# Altium project Kasli-SOC.PrjPcb (part 10 of 11)

## Sheet Kasli-SOC_linear.SchDoc: LDOs
size 420 x 297 mm; CheckedBy: G.Kasprowicz; Author: F.Switakowski; CompanyName: WUT ISE; DrawnBy: F.Switakowski; Organization: WUT ISE; Address1: PW ISE; Address2: Nowowiejska 15/19 00-665 Warsaw; Address3: gkasprow@gmail.com; DocumentNumber: 17; Revision: 1; SheetNumber: 17; SheetTotal: 18; ModifiedBy: -; CheckedDate: -; Title2: & DDR reference; DivGrp: WUT ISE; Designer: G.Kasprowicz; ModifiedDate: -; ProjectName: Sensor Box
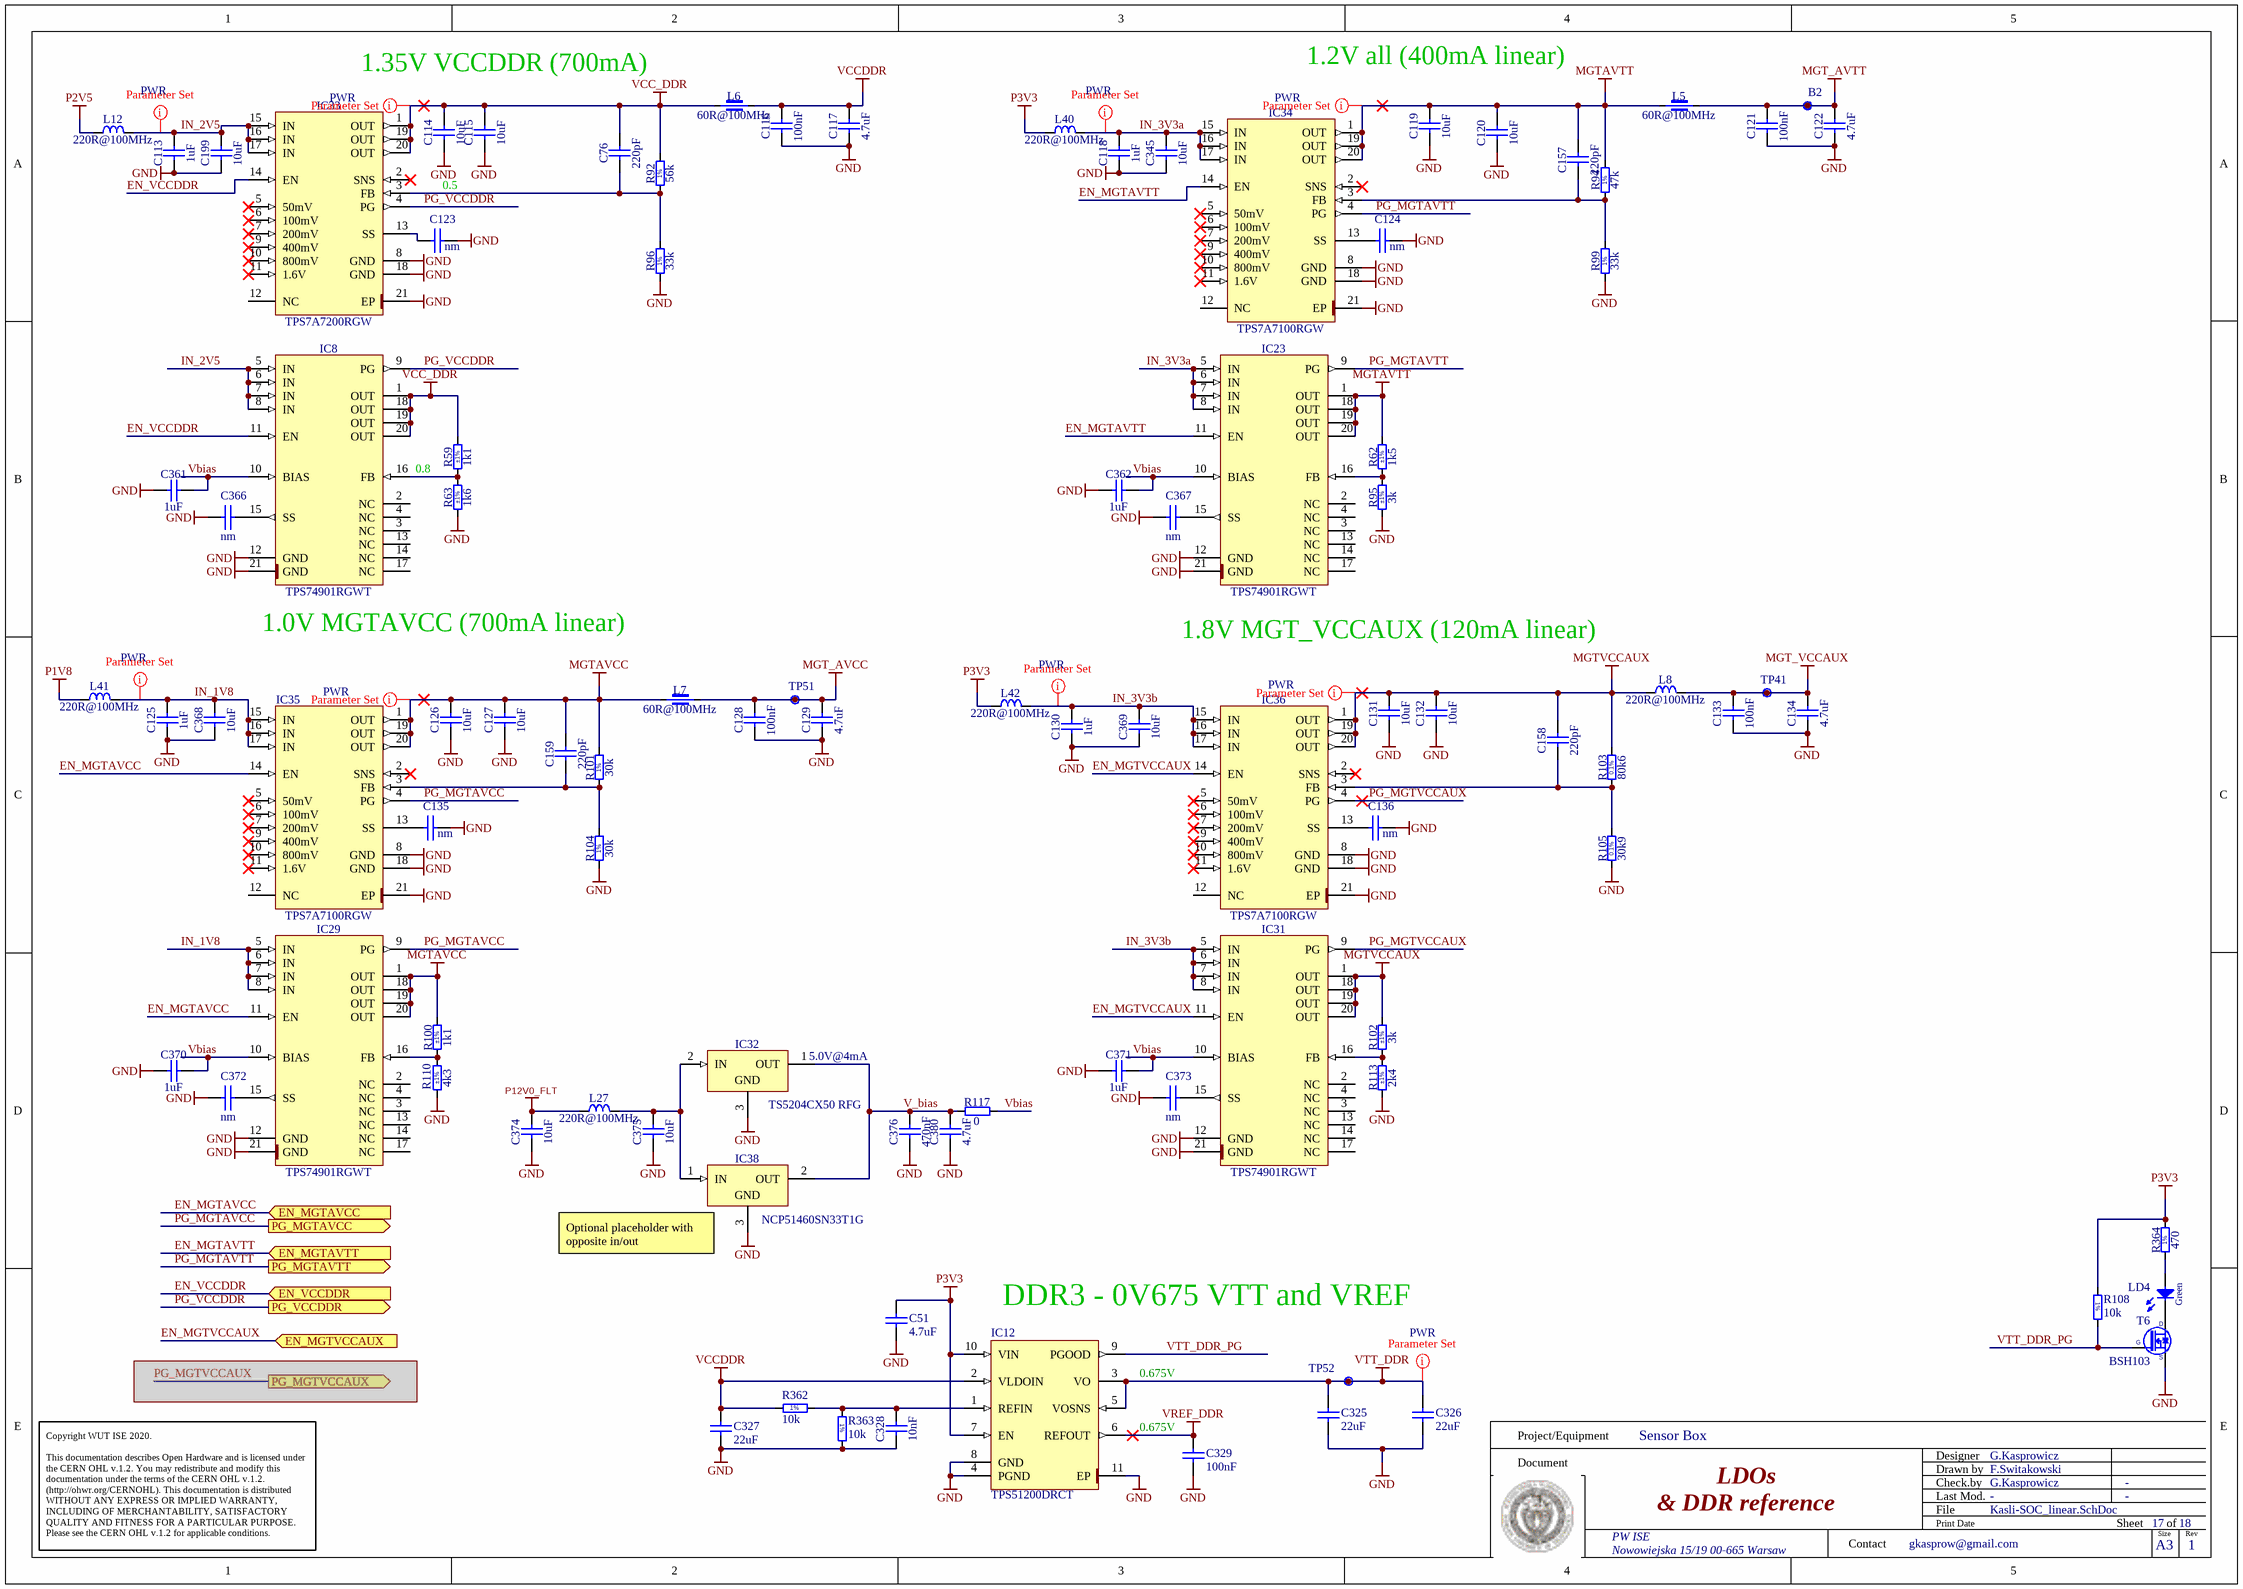
[diagram p15: Kasli-SOC_linear.SchDoc]

### Parts
B2  SMD Pad  [C75]  (value not drawn)  (no BOM)
C51  4.7uF  [CAPC1608X87N]
C76  220pF  [CAPC1005X55N]
C113  1uF  [CAPC1608X87N]
C114  10uF  [CAPC1005X70N]
C115  10uF  [CAPC1005X70N]
C116  100nF  [CAPC1005X55N]
C117  4.7uF  [CAPC1005X55N]
C118  1uF  [CAPC1608X87N]
C119  10uF  [CAPC1005X70N]
C120  10uF  [CAPC1005X70N]
C121  100nF  [CAPC1005X55N]
C122  4.7uF  [CAPC1005X55N]
C123  nm  [0402C]
C124  nm  [0402C]
C125  1uF  [CAPC1608X87N]
C126  10uF  [CAPC1005X70N]
C127  10uF  [CAPC1005X70N]
C128  100nF  [CAPC1005X55N]
C129  4.7uF  [CAPC1005X55N]
C130  1uF  [CAPC1608X87N]
C131  10uF  [CAPC1005X70N]
C132  10uF  [CAPC1005X70N]
C133  100nF  [CAPC1005X55N]
C134  4.7uF  [CAPC1005X55N]
C135  nm  [0402C]
C136  nm  [0402C]
C157  220pF  [CAPC1005X55N]
C158  220pF  [CAPC1005X55N]
C159  220pF  [CAPC1005X55N]
C199  10uF  [CAPC1005X70N]
C325  22uF  [CAPC3216X180N]
C326  22uF  [CAPC3216X180N]
C327  22uF  [CAPC3216X180N]
C328  10nF  [CAPC1005X55N]
C329  100nF  [CAPC1005X55N]
C345  10uF  [CAPC1005X70N]
C361  1uF  [CAPC1005X55N]
C362  1uF  [CAPC1005X55N]
C366  nm  [0402C]
C367  nm  [0402C]
C368  10uF  [CAPC1005X70N]
C369  10uF  [CAPC1005X70N]
C370  1uF  [CAPC1005X55N]
C371  1uF  [CAPC1005X55N]
C372  nm  [0402C]
C373  nm  [0402C]
C374  10uF  [CAPC2012X95N]
C375  10uF  [CAPC2012X95N]
C376  470nF  [CAPC1608X87N]
C380  4.7uF  [CAPC1005X55N]
IC8  TPS74901RGWT  [QFN65P500X500X100-21N-S325]
IC12  TPS51200DRCT  [TEXAS_DRC (S-PVSON-N10)]
IC23  TPS74901RGWT  [QFN65P500X500X100-21N-S325]
IC29  TPS74901RGWT  [QFN65P500X500X100-21N-S325]
IC31  TPS74901RGWT  [QFN65P500X500X100-21N-S325]
IC32  TS5204CX50 RFG  [SOT95P280X115-3N]
IC33  TPS7A7200RGW  [QFN65P500X500X100-21N-S325]
IC34  TPS7A7100RGW  [QFN65P500X500X100-21N-S325]
IC35  TPS7A7100RGW  [QFN65P500X500X100-21N-S325]
IC36  TPS7A7100RGW  [QFN65P500X500X100-21N-S325]
IC38  NCP51460SN33T1G  [SOT95P240X110-3N]
L5  60R@100MHz  [INDC4516X180N]
L6  60R@100MHz  [INDC4516X180N]
L7  60R@100MHz  [INDC4516X180N]
L8  220R@100MHz  [INDC2012X105N]
L12  220R@100MHz  [INDC2012X105N]
L27  220R@100MHz  [INDC2012X105N]
L40  220R@100MHz  [INDC2012X105N]
L41  220R@100MHz  [INDC2012X105N]
L42  220R@100MHz  [INDC2012X105N]
LD4  Green  [LED_KINGBRIGHT_KPH-1608CGCK]
R59  1k1  Tolerance: ±1%  [RESC1005X40N]
R62  1k5  Tolerance: ±1%  [RESC1005X40N]
R63  1k6  Tolerance: ±1%  [RESC1005X40N]
R92  56k  [RESC1005X40N]
R94  47k  [RESC1005X40N]
R95  3k  Tolerance: ±1%  [RESC1005X40N]
R96  33k  [RESC1005X40N]
R99  33k  [RESC1005X40N]
R100  1k1  Tolerance: ±1%  [RESC1005X40N]
R101  30k  [RESC1005X40N]
R102  3k  Tolerance: ±1%  [RESC1005X40N]
R103  80k6  [RESC1608X55N]
R104  30k  [RESC1005X40N]
R105  30k9  [RESC1608X55N]
R108  10k  [RESC1005X40N]
R110  4k3  Tolerance: ±1%  [RESC1005X40N]
R113  2k4  Tolerance: ±1%  [RESC1005X40N]
R117  0  [RESC1005X40N]
R362  10k  [RESC1005X40N]
R363  10k  [RESC1005X40N]
R364  470  [RESC1005X40N]
T6  BSH103  [SOT95P230X110-3N]
TP41  Test Point  [TPS127]  (value not drawn)  (no BOM)
TP51  Test Point  [TPS127]  (value not drawn)  (no BOM)
TP52  Test Point  [TPS127]  (value not drawn)  (no BOM)

### Ports
EN_MGTAVCC (in), EN_MGTAVTT (in), EN_MGTVCCAUX (in), EN_VCCDDR (in), PG_MGTAVCC (out), PG_MGTAVTT (out), PG_MGTVCCAUX (out), PG_VCCDDR (out)

### Nets
GND: C51.2 C113.1 C114.1 C115.1 C116.1 C117.1 C118.1 C119.1 C120.1 C121.1 C122.1 C123.2 C124.2 C125.1 C126.1 C127.1 C128.1 C129.1 C130.1 C131.1 C132.1 C133.1 C134.1 C135.2 C136.2 C199.1 C325.2 C326.2 C327.2 C328.1 C329.1 C345.1 C361.1 C362.1 C366.2 C367.2 C368.1 C369.1 C370.1 C371.1 C372.2 C373.2 C374.1 C375.1 C376.1 C380.1 IC8.12(GND) IC8.21(GND) IC12.4(PGND) IC12.8(GND) IC12.11(EP) IC23.12(GND) IC23.21(GND) IC29.12(GND) IC29.21(GND) IC31.12(GND) IC31.21(GND) IC32.3(GND) IC33.8(GND) IC33.18(GND) IC33.21(EP) IC34.8(GND) IC34.18(GND) IC34.21(EP) IC35.8(GND) IC35.18(GND) IC35.21(EP) IC36.8(GND) IC36.18(GND) IC36.21(EP) IC38.3(GND) R63.1 R95.1 R96.1 R99.1 R104.1 R105.1 R110.1 R113.1 R363.2 T6.2(S)
MGT_AVCC: C128.2 C129.2 L7.2 TP51.1
MGT_AVTT: B2.1 C121.2 C122.2 L5.2
MGT_VCCAUX: C133.2 C134.2 L8.2 TP41.1
MGTAVCC: C126.2 C127.2 C159.2 IC29.1(OUT) IC29.18(OUT) IC29.19(OUT) IC29.20(OUT) IC35.1(OUT) IC35.19(OUT) IC35.20(OUT) L7.1 R100.2 R101.2
MGTAVTT: C119.2 C120.2 C157.2 IC23.1(OUT) IC23.18(OUT) IC23.19(OUT) IC23.20(OUT) IC34.1(OUT) IC34.19(OUT) IC34.20(OUT) L5.1 R62.2 R94.2
MGTVCCAUX: C131.2 C132.2 C158.2 IC31.1(OUT) IC31.18(OUT) IC31.19(OUT) IC31.20(OUT) IC36.1(OUT) IC36.19(OUT) IC36.20(OUT) L8.1 R102.2 R103.2
P1V8: L41.1
P2V5: L12.1
P3V3: C51.1 IC12.7(EN) IC12.10(VIN) L40.1 L42.1 R108.1 R364.2
P12V0_FLT: C374.2 L27.1
VCC_DDR: C76.2 C114.2 C115.2 IC8.1(OUT) IC8.18(OUT) IC8.19(OUT) IC8.20(OUT) IC33.1(OUT) IC33.19(OUT) IC33.20(OUT) L6.1 R59.2 R92.2
VCCDDR: C116.2 C117.2 C327.1 IC12.2(VLDOIN) L6.2 R362.1
VREF_DDR: C329.2 IC12.6(REFOUT)
VTT_DDR: C325.1 C326.1 IC12.3(VO) IC12.5(VOSNS) TP52.1
EN_MGTAVCC: IC29.11(EN) IC35.14(EN) ; port EN_MGTAVCC
EN_MGTAVTT: IC23.11(EN) IC34.14(EN) ; port EN_MGTAVTT
EN_MGTVCCAUX: IC31.11(EN) IC36.14(EN) ; port EN_MGTVCCAUX
EN_VCCDDR: IC8.11(EN) IC33.14(EN) ; port EN_VCCDDR
IN_1V8: C125.2 C368.2 IC29.5(IN) IC29.6(IN) IC29.7(IN) IC29.8(IN) IC35.15(IN) IC35.16(IN) IC35.17(IN) L41.2
IN_2V5: C113.2 C199.2 IC8.5(IN) IC8.6(IN) IC8.7(IN) IC8.8(IN) IC33.15(IN) IC33.16(IN) IC33.17(IN) L12.2
IN_3V3a: C118.2 C345.2 IC23.5(IN) IC23.6(IN) IC23.7(IN) IC23.8(IN) IC34.15(IN) IC34.16(IN) IC34.17(IN) L40.2
IN_3V3b: C130.2 C369.2 IC31.5(IN) IC31.6(IN) IC31.7(IN) IC31.8(IN) IC36.15(IN) IC36.16(IN) IC36.17(IN) L42.2
PG_MGTAVCC: IC29.9(PG) IC35.4(PG) ; port PG_MGTAVCC
PG_MGTAVTT: IC23.9(PG) IC34.4(PG) ; port PG_MGTAVTT
PG_MGTVCCAUX: IC31.9(PG) IC36.4(PG)
PG_VCCDDR: IC8.9(PG) IC33.4(PG) ; port PG_VCCDDR
V_bias: C376.2 C380.2 IC32.1(OUT) IC38.2(OUT) R117.1
Vbias: C361.2 C362.2 C370.2 C371.2 IC8.10(BIAS) IC23.10(BIAS) IC29.10(BIAS) IC31.10(BIAS) R117.2
VTT_DDR_PG: IC12.9(PGOOD) R108.2 T6.1(G)
NetC76_1: C76.1 IC33.3(FB) R92.1 R96.2
NetC123_1: C123.1 IC33.13(SS)
NetC124_1: C124.1 IC34.13(SS)
NetC135_1: C135.1 IC35.13(SS)
NetC136_1: C136.1 IC36.13(SS)
NetC157_1: C157.1 IC34.3(FB) R94.1 R99.2
NetC158_1: C158.1 IC36.3(FB) R103.1 R105.2
NetC159_1: C159.1 IC35.3(FB) R101.1 R104.2
NetC328_2: C328.2 IC12.1(REFIN) R362.2 R363.1
NetC366_1: C366.1 IC8.15(SS)
NetC367_1: C367.1 IC23.15(SS)
NetC372_1: C372.1 IC29.15(SS)
NetC373_1: C373.1 IC31.15(SS)
NetC375_2: C375.2 IC32.2(IN) IC38.1(IN) L27.2
NetIC8_16: IC8.16(FB) R59.1 R63.2
NetIC23_16: IC23.16(FB) R62.1 R95.2
NetIC29_16: IC29.16(FB) R100.1 R110.2
NetIC31_16: IC31.16(FB) R102.1 R113.2
NetLD4_1: LD4.1(C) T6.3(D)
NetLD4_2: LD4.2(A) R364.1

Not connected (* = marked no-connect by the designer): IC8 2(NC) 3(NC) 4(NC) 13(NC) 14(NC) 17(NC); IC23 2(NC) 3(NC) 4(NC) 13(NC) 14(NC) 17(NC); IC29 2(NC) 3(NC) 4(NC) 13(NC) 14(NC) 17(NC); IC31 2(NC) 3(NC) 4(NC) 13(NC) 14(NC) 17(NC); IC33 2(SNS)* 5(50mV)* 6(100mV)* 7(200mV)* 9(400mV)* 10(800mV)* 11(1.6V)* 12(NC); IC34 2(SNS)* 5(50mV)* 6(100mV)* 7(200mV)* 9(400mV)* 10(800mV)* 11(1.6V)* 12(NC); IC35 2(SNS)* 5(50mV)* 6(100mV)* 7(200mV)* 9(400mV)* 10(800mV)* 11(1.6V)* 12(NC); IC36 2(SNS)* 5(50mV)* 6(100mV)* 7(200mV)* 9(400mV)* 10(800mV)* 11(1.6V)* 12(NC)

### Layout directives
net class PWR: IN_1V8, IN_2V5, IN_3V3a, IN_3V3b, MGTAVCC, MGTAVTT, MGTVCCAUX, VCC_DDR, VTT_DDR

### Notes on the sheet
- 1.35V VCCDDR (700mA)
- 1.2V all (400mA linear)
- 0.5
- 0.8
- (near IC8) 1.0V MGTAVCC (700mA linear)
- 1.8V MGT_VCCAUX (120mA linear)
- (near IC32) 5.0V@4mA
- (near IC38) Optional placeholder with opposite in/out
- (near IC12) DDR3 - 0V675 VTT and VREF
- (near IC12) 0.675V
- (near C329) 0.675V
- Project/Equipment
- Document
- Designer
- Drawn by
- Check.by
- Copyright WUT ISE 2020.
  This documentation describes Open Hardware and is licensed under the CERN OHL v.1.2. You may redistribute and modify this documentation under the terms of the CERN OHL v.1.2. (http://ohwr.org/CERNOHL). This documentation is distributed WITHOUT ANY EXPRESS OR IMPLIED WARRANTY, INCLUDING OF MERCHANTABILITY, SATISFACTORY QUALITY AND FITNESS FOR A PARTICULAR PURPOSE. Please see the CERN OHL v.1.2 for applicable conditions.
- Contact
- File
- Last Mod.
- Print Date
- Sheet
- Size
- A3
- of
- Rev
- (in symbol R0402_10K_1%_0.0625W_100PPM) 1%
- (in symbol R0402_30K_1%_0.0625W_100PPM) 1%
- (in symbol R0402_33K_1%_0.0625W_100PPM) 1%
- (in symbol R0402_47K_1%_0.0625W_100PPM) 1%
- (in symbol R0402_56K_1%_0.0625W_100PPM) 1%
- (in symbol R0402_470R_1%_0.0625W_100PPM) 1%
- (in symbol R0603_30K9_0.1%_0.063W_10PPM) 0.1%
- (in symbol R0603_80K6_0.1%_0.063W_10PPM) 0.1%

### Library data of the parts
B2 = SMD_PAD_D0.75MM: as B7-B10 on sheet Kasli-SOC_QUAD_BUCK; Part Number: SMD_PAD_D0.75MM; Component Type: Standard (No BOM); Pin Count: 1; Family: SMD Pad; Socket: No; SMD: No; Sense: No; Status: None; ComponentHeight: 0mm; HelpURL: Undefined; Author: CERN DEM BC; CreateDate: 04.06.2020; LatestRevisionDate: 04.06.2020; PackageDescription: 0.75mm Diameter SMD Pad
C51 = CC0603_4.7UF_6.3V_10%_X5R: Non-polarised capacitor; Part Description: SMD Multilayer Chip Ceramic Capacitor; Manufacturer: GENERIC; Manufacturer1 Part Number: 225520613672; Voltage: 6.3V; TC: X5R; Tolerance: ±10%; Table: Capacitors SMD; Part Number: CC0603_4.7UF_6.3V_10%_X5R; Component Kind: Standard; Component Type: Standard; Pin Count: 2; Value: 4.7uF; Status: Preferred; Manufacturer Part Number: CC0603_4.7uF_6.3V_10%_X5R; Case: 0603; Mounted: Yes; Socket: No; SMD: Yes; Manufacturer1 Example: PHYCOMP; Manufacturer1 ComponentHeight: 0.87mm; HelpURL: \\cern.ch\dfs\Applications\Altium\Datasheets\CC0805_X5R_PHYCOMP_HC.pdf; Author: CERN DEM JLC; CreateDate: 2007-12-03; LatestRevisionDate: 2007-12-03
C76 C157-C159 = CC0402_220PF_50V_5%_C0G: Non-polarised capacitor; Part Description: SMD Multilayer Chip Ceramic Capacitor; Manufacturer: GENERIC; Manufacturer1 Part Number: C0402C221J5GACTU; Voltage: 50V; TC: C0G/NP0; Tolerance: ±5%; Part Number: CC0402_220PF_50V_5%_C0G; Component Kind: Standard; Component Type: Standard; Pin Count: 2; Value: 220pF; Status: Preferred; Manufacturer Part Number: CC0402_220PF_50V_5%_C0G; Case: 0402; Mounted: Yes; Socket: No; SMD: Yes; Sense: No; Manufacturer1 Example: KEMET; Manufacturer1 ComponentHeight: 0.55mm; HelpURL: \\cern.ch\dfs\Applications\Altium\Datasheets\CC0402_C0G_KEMET_(Commercial Grade).pdf; Author: CERN DEM JLC; CreateDate: 03.12.2007; LatestRevisionDate: 22.04.2015
C113 C118 C125 C130 = CC0603_1UF_25V_10%_X7R: Non-polarised capacitor; Part Description: SMD Multilayer Chip Ceramic Capacitor; Manufacturer: GENERIC; Manufacturer1 Part Number: GRM188R71E105KA12D; Voltage: 25V; TC: X7R; Tolerance: ±10%; Part Number: CC0603_1UF_25V_10%_X7R; Component Kind: Standard; Component Type: Standard; Pin Count: 2; Value: 1uF; Status: None; Manufacturer Part Number: CC0603_1UF_25V_10%_X7R; Case: 0603; Mounted: Yes; Socket: No; SMD: Yes; Sense: No; Manufacturer1 Example: MURATA; Manufacturer1 ComponentHeight: 0.9mm; HelpURL: \\cern.ch\dfs\Applications\Altium\Datasheets\CC0603_X7R_MURATA.pdf; Author: CERN DEM JLC; CreateDate: 18.01.2011; LatestRevisionDate: 18.01.2011
C114 C115 C119 C120 C126 C127 C131 C132 C199 C345 C368 C369 = CC0402_10UF_6.3V_20%_X5R: Non-polarised capacitor; Part Description: SMD Multilayer Chip Ceramic Capacitor; Manufacturer: GENERIC; Manufacturer1 Part Number: C1005X5R0J106M050BC; Voltage: 6.3V; TC: X5R; Tolerance: ±10%; Part Number: CC0402_10UF_6.3V_20%_X5R; Component Kind: Standard; Component Type: Standard; Pin Count: 2; Value: 10uF; Status: Preferred; Manufacturer Part Number: CC0402_10UF_6.3V_20%_X5R; Case: 0402; Mounted: Yes; Socket: No; SMD: Yes; Sense: No; Manufacturer1 Example: TDK; Manufacturer1 ComponentHeight: 0.70mm; HelpURL: \\cern.ch\dfs\Applications\Altium\Datasheets\CC0402_X5R_TDK_C.pdf; Author: CERN DEM JLC; CreateDate: 07.01.2015; LatestRevisionDate: 07.01.2015
C116 C121 C128 C133 = CC0402_100NF_16V_10%_X7R: as C146-C153 on sheet Kasli-SOC_QUAD_BUCK; Part Number: CC0402_100NF_16V_10%_X7R; Component Kind: Standard; Component Type: Standard; Pin Count: 2; Value: 100nF; Status: Not Recommended; Manufacturer Part Number: CC0402_100NF_16V_10%_X7R; Case: 0402; Mounted: Yes; Socket: No; SMD: Yes; Sense: No; Manufacturer1 Example: MURATA; Manufacturer1 ComponentHeight: 0.55mm; HelpURL: \\cern.ch\dfs\Applications\Altium\Datasheets\CC0402_X7R_MURATA_GRM.pdf; Author: CERN DEM JLC; CreateDate: 05/12/2013; LatestRevisionDate: 03/12/2007
C117 C122 C129 C134 C380 = CC0402_4.7UF_6.3V_20%_X5R: Non-polarised capacitor; Part Description: SMD Multilayer Chip Ceramic Capacitor; Manufacturer: GENERIC; Manufacturer1 Part Number: C1005X5R0J475M050BC; Voltage: 6.3V; TC: X5R; Tolerance: ±20%; Part Number: CC0402_4.7UF_6.3V_20%_X5R; Component Kind: Standard; Component Type: Standard; Pin Count: 2; Value: 4.7uF; Status: Preferred; Manufacturer Part Number: CC0402_4.7UF_6.3V_20%_X5R; Case: 0402; Mounted: Yes; Socket: No; SMD: Yes; Sense: No; Manufacturer1 Example: TDK; Manufacturer1 ComponentHeight: 0.65mm; HelpURL: \\cern.ch\dfs\Applications\Altium\Datasheets\CC0402_X5R_TDK_C.pdf; Author: CERN DEM JLC; CreateDate: 03/03/2015; LatestRevisionDate: 03/03/2015
C123 C124 C135 C136 C366 C367 C372 C373 = CAP_SMD_0402: Capacitor SMD
C325-C327 = CC1206_22UF_10V_10%_X7R: Non-polarised capacitor; Part Description: SMD Multilayer Chip Ceramic Capacitor; Manufacturer: GENERIC; Manufacturer1 Part Number: GRM31CR71A226KE15L; Voltage: 10V; TC: X7R; Tolerance: ±10%; Table: Capacitors SMD; Part Number: CC1206_22UF_10V_10%_X7R; Component Kind: Standard; Component Type: Standard; Pin Count: 2; Value: 22uF; Status: Preferred; Manufacturer Part Number: CC1206_22UF_10V_10%_X7R; Case: 1206; Mounted: Yes; Socket: No; SMD: Yes; Manufacturer1 Example: MURATA; Manufacturer1 ComponentHeight: 1.8mm; HelpURL: \\cern.ch\dfs\Applications\Altium\Datasheets\CC1206_X7R_MURATA_GRM-HI-CAP.pdf; Author: CERN DEM JLC; CreateDate: 2010-06-08; LatestRevisionDate: 2010-06-08
C328 = CC0402_10NF_16V_10%_X7R: Non-polarised capacitor; Part Description: SMD Multilayer Chip Ceramic Capacitor; Manufacturer: GENERIC; Manufacturer1 Part Number: 223878715636; Voltage: 16V; TC: X7R; Tolerance: ±10%; Part Number: CC0402_10NF_16V_10%_X7R; Component Kind: Standard; Component Type: Standard; Pin Count: 2; Value: 10nF; Status: Not Recommended; Manufacturer Part Number: CC0402_10NF_16V_10%_X7R; Case: 0402; Mounted: Yes; Socket: No; SMD: Yes; Sense: No; Manufacturer1 Example: PHYCOMP; Manufacturer1 ComponentHeight: 0.55mm; HelpURL: \\cern.ch\dfs\Applications\Altium\Datasheets\CC0402_X7R_PHYCOMP.pdf; Author: CERN DEM JLC; CreateDate: 03.12.2007; LatestRevisionDate: 03.12.2007
C329 = CC0402_100NF_16V_10%_X7R: Non-polarised capacitor; Part Description: SMD Multilayer Chip Ceramic Capacitor; Manufacturer: GENERIC; Manufacturer1 Part Number: GRM155R71C104KA88D; Voltage: 16V; TC: X7R; Tolerance: ±10%; Table: Capacitors SMD; Part Number: CC0402_100NF_16V_10%_X7R; Component Kind: Standard; Component Type: Standard; Pin Count: 2; Value: 100nF; Status: Not Recommended; Manufacturer Part Number: CC0402_100NF_16V_10%_X7R; Case: 0402; Mounted: Yes; Socket: No; SMD: Yes; Manufacturer1 Example: MURATA; Manufacturer1 ComponentHeight: 0.55mm; HelpURL: \\cern.ch\dfs\Applications\Altium\Datasheets\CC0402_X7R_MURATA_GRM.pdf; Author: CERN DEM JLC; CreateDate: 2013-12-05; LatestRevisionDate: 2007-12-03
C361 C362 C370 C371 = CC0402_1UF_16V_10%_X5R: Non-polarised capacitor; Part Description: SMD Multilayer Chip Ceramic Capacitor; Manufacturer: GENERIC; Manufacturer1 Part Number: C1005X5R1C105KT; Voltage: 16V; TC: X5R; Tolerance: ±10%; Part Number: CC0402_1UF_16V_10%_X5R; Component Kind: Standard; Component Type: Standard; Pin Count: 2; Value: 1uF; Status: Preferred; Manufacturer Part Number: CC0402_1UF_16V_10%_X5R; Case: 0402; Mounted: Yes; Socket: No; SMD: Yes; Sense: No; Manufacturer1 Example: TDK; Manufacturer1 ComponentHeight: 0.55mm; HelpURL: \\cern.ch\dfs\Applications\Altium\Datasheets\CC0402_X5R_TDK_C.pdf; Author: CERN DEM JLC; CreateDate: 25.10.2012; LatestRevisionDate: 25.10.2012
C374 C375 = CC0805_10UF_25V_10%_X5R: Non-polarised capacitor; Part Description: SMD Multilayer Chip Ceramic Capacitor; Manufacturer: GENERIC; Manufacturer1 Part Number: GRM219R61E106KA12D; Voltage: 25V; TC: X5R; Tolerance: ±10%; Part Number: CC0805_10UF_25V_10%_X5R; Component Kind: Standard; Component Type: Standard; Pin Count: 2; Value: 10uF; Status: Preferred; Manufacturer Part Number: CC0805_10UF_25V_10%_X5R; Case: 0805; Mounted: Yes; Socket: No; SMD: Yes; Sense: No; Manufacturer1 Example: MURATA; Manufacturer1 ComponentHeight: 0.95mm; HelpURL: \\cern.ch\dfs\Applications\Altium\Datasheets\CC0805_X5R_MURATA_GRM.pdf; Author: CERN DEM JLC; CreateDate: 25.10.2012; LatestRevisionDate: 06.09.2016
C376 = CC0603_470NF_16V_10%_X5R: Non-polarised capacitor; Part Description: SMD Multilayer Chip Ceramic Capacitor; Manufacturer: GENERIC; Manufacturer1 Part Number: 223878613658; Voltage: 16V; TC: X5R; Tolerance: ±10%; Part Number: CC0603_470NF_16V_10%_X5R; Component Kind: Standard; Component Type: Standard; Pin Count: 2; Value: 470nF; Status: Preferred; Manufacturer Part Number: CC0603_470NF_16V_10%_X5R; Case: 0603; Mounted: Yes; Socket: No; SMD: Yes; Sense: No; Manufacturer1 Example: PHYCOMP; Manufacturer1 ComponentHeight: 0.87mm; HelpURL: \\cern.ch\dfs\Applications\Altium\Datasheets\CC0805_X5R_PHYCOMP_HC.pdf; Author: CERN DEM JLC; CreateDate: 03.12.2007; LatestRevisionDate: 03.12.2007
IC8 IC23 IC29 IC31 = TPS74901RGWT: 3A, 0.8 to 3.6V Adjustable Low-Dropout Linear Regulator with Programmable Soft-Start; Part Description: 0.8V to 3.6V, 3.0A Low Dropout Linear Regulator with Programmable Soft-Start; Manufacturer: TEXAS INSTRUMENTS; PressFit: No; Bonding: No; Part Number: TPS74901RGWT; Component Kind: Standard; Component Type: Standard; Device: TPS74901RGWT; PackageDescription: QFN, 0.65mm Pitch, Square; 20 Pin, 5.00mm L X 5.00mm W X 1.00mm H body (w/Thermal Tab 3.25 X 3.25mm), IPC Medium Density; Manufacturer Part Number: TPS74901RGW; Pin Count: 21; Case: QFN20; Mounted: Yes; Socket: No; SMD: Yes; Sense: No; ComponentHeight: 1mm; HelpURL: \\cern.ch\dfs\Applications\Altium\Datasheets\TPS74901RGWT.pdf; Author: CERN DEM JLC; CreateDate: 07.03.2013; LatestRevisionDate: 13.06.2022
IC12 = TPS51200DRCT: Sink/Source DDR Termination Regulator; Part Description: 3.3V Sink/Source DDR Termination Regulator; Manufacturer: TEXAS INSTRUMENTS; Table: Regulators; Part Number: TPS51200DRCT; Component Kind: Standard; Component Type: Standard; Device: TPS51200DRCT; PackageDescription: SON, 0.50mm Pitch, 10-pin, 3.00mm W  X 3.00mm L X 1.00mm Height, (w/thermal tab 1.75 X 2.50 mm); Manufacturer Part Number: TPS51200DRCT; Pin Count: 11; Case: SON10; Mounted: Yes; Socket: No; SMD: Yes; ComponentHeight: 1mm; HelpURL: \\cern.ch\dfs\Applications\Altium\Datasheets\TPS51200DRCT.pdf; Author: CERN DEM JLC; CreateDate: 2010-02-03; LatestRevisionDate: 2013-11-06
IC32 = TS3480CX33RF: 3-Terminal Regulator 1=OUT 2=IN 3=GND; Part Description: 5.0 Low Quiescient Current LDO Voltage Regulator; Manufacturer: TAIWAN SEMICONDUCTOR; PressFit: No; Bonding: No; Part Number: TS5204CX50 RFG; Component Kind: Standard; Component Type: Standard; Device: TS5204CX50 RFG; PackageDescription: SOT23SOT, 0.95mm Pitch; 3 Pin, 1.55mm W X 2.95mm L X 1.15mm H body, IPC Medium Density; Manufacturer Part Number: TS5204CX50 RFG; Pin Count: 3; Case: SOT23; Mounted: Yes; Socket: No; SMD: Yes; Sense: No; ComponentHeight: 1.15mm; HelpURL: \\cern.ch\dfs\Applications\Altium\Datasheets\TS3480CX33RF.pdf; Author: CERN DEM JLC; CreateDate: 19.05.2010; LatestRevisionDate: 19.05.2010
IC33 = TPS7A7200RGW: 2-A, Fast-Transient, Low-Dropout Voltage Regulator; Manufacturer: TEXAS INSTRUMENTS; PressFit: No; Bonding: No; Part Number: TPS7A7200RGW; Component Kind: Standard; Component Type: Standard; Device: TPS7A7200RGW; PackageDescription: QFN, 0.65mm pitch,square; 20 pin, 5mm X 5mm X 1mm H body (w/thermal tab 3.25 X 3.25mm),  IPC Medium Density; Part Description: 2-A, Fast-Transient, Low-Dropout Voltage Regulator; Manufacturer Part Number: TPS7A7200RGW; Pin Count: 21; Case: QFN20; Mounted: Yes; Socket: No; SMD: Yes; Sense: No; ComponentHeight: 1mm; HelpURL: \\cern.ch\dfs\Applications\Altium\Datasheets\TPS7A7200RGW.pdf; Author: CERN DEM MR; CreateDate: 17.03.2016; LatestRevisionDate: 17.03.2016
IC34-IC36 = TPS7A7100RGW: 1-A, Fast-Transient, Low-Dropout Voltage Regulator; Manufacturer: TEXAS INSTRUMENTS; PressFit: No; Bonding: No; Part Number: TPS7A7100RGW; Component Kind: Standard; Component Type: Standard; Device: TPS7A7100RGW; PackageDescription: QFN, 0.65mm pitch,square; 20 pin, 5mm X 5mm X 1mm H body (w/thermal tab 3.25 X 3.25mm),  IPC Medium Density; Part Description: 1-A, Fast-Transient, Low-Dropout Voltage Regulator; Manufacturer Part Number: TPS7A7100RGW; Pin Count: 21; Case: QFN20; Mounted: Yes; Socket: No; SMD: Yes; Sense: No; ComponentHeight: 1mm; HelpURL: \\cern.ch\dfs\Applications\Altium\Datasheets\TPS7A7100RGW.pdf; Author: CERN DEM MR; CreateDate: 17.03.2016; LatestRevisionDate: 17.03.2016
IC38 = NCP51460SN33T1G: 3-Terminal Regulator 1=IN 2=OUT 3=GND; Part Number: NCP51460SN50T1G; Part Description: 3.3V, 20mA Micropower Precision Voltage Reference; Manufacturer: ON SEMICONDUCTOR; PressFit: No; Bonding: No; Component Kind: Standard; Component Type: Standard; Device: NCP51460SN33T1G; PackageDescription: SOT23 3-Leads, Pitch 0.95mm - Body 1.4x3mm, IPC Medium Density; Manufacturer Part Number: NCP51460SN33T1; Pin Count: 3; Case: SOT23; Mounted: Yes; Socket: No; SMD: Yes; Sense: No; ComponentHeight: 1.1mm; HelpURL: \\cern.ch\dfs\Applications\Altium\Datasheets\NCP51460SN33T1G.pdf; Author: CERN DEM MR; CreateDate: 05.10.2016; LatestRevisionDate: 24.05.2022
L5-L7 = IND1806_MURATA_BLM41PG600SN1L: Manufacturer: MURATA; Part Description: SMD EMI Suppression Chip Ferrite Bead (BLM41P Series); Power: 6A; Resistance: 0.01R; Manufacturer Part Number: BLM41PG600SN1L; Part Number: IND1806_MURATA_BLM41PG600SN1L; Value: 60R@100MHz; Component Kind: Standard; Component Type: Standard; Pin Count: 2; Status: None; Case: 1806; Mounted: Yes; Socket: No; SMD: Yes; Sense: No; ComponentHeight: 1.8mm; HelpURL: \\cern.ch\dfs\Applications\Altium\Datasheets\IND1806_MURATA_BLM41P.pdf; Author: CERN DEM JLC; CreateDate: 02.12.2009; LatestRevisionDate: 02.12.2009
L8 L12 L27 L40-L42 = IND0805_MURATA_BLM21PG221SN1D: Inductor; Part Description: SMD EMIFIL Suppression Chip Ferrite Bead; Manufacturer: MURATA; Power: 2A; Resistance: 0.05R; Tolerance: ±25%; Part Number: IND0805_MURATA_BLM21PG221SN1D; Component Kind: Standard; Component Type: Standard; Pin Count: 2; Value: 220R@100MHz; Status: None; Manufacturer Part Number: BLM21PG221SN1D; Case: 0805; Mounted: Yes; Socket: No; SMD: Yes; Sense: No; ComponentHeight: 1.05mm; HelpURL: \\cern.ch\dfs\Applications\Altium\Datasheets\IND0805_MURATA_BLM21P.pdf; Author: CERN DEM JLC; CreateDate: 25/01/2010; LatestRevisionDate: 25/01/2010
LD4 = LED_KINGBRIGHT_KPH-1608CGCK: LED Green 1C 2A; Part Description: SMD Green LED, Case 1.6mmX0.8mm(0603), 0.65mm Thickness; PressFit: No; Bonding: No; Manufacturer Part Number: KPH-1608CGCK; ComponentHeight: 0.65mm; HelpURL: \\cern.ch\dfs\Applications\Altium\Datasheets\LED_KINGBRIGHT_KPH-1608CGCK.pdf; Part Number: LED_KINGBRIGHT_KPH-1608CGCK; Component Kind: Standard; Component Type: Standard; Color: Green; PackageDescription: SMT Green LED, Case 0603, Body L 1.6 x W 0.8mm H 0.65mm; Manufacturer: KINGBRIGHT; Pin Count: 2; Mounted: Yes; Socket: No; SMD: Yes; Sense: No; Author: CERN DEM JLC; CreateDate: 03.07.2017; LatestRevisionDate: 03.07.2017
R59 R100 = R0402_1K1_1%_0.0625W_100PPM: Resistor - 1%; Part Description: General Purpose Thick Film Chip Resistor; Manufacturer: GENERIC; Manufacturer1 Part Number: 232270671102L; TC: ±100ppm/°C; PressFit: No; Part Number: R0402_1K1_1%_0.0625W_100PPM; Component Kind: Standard; Component Type: Standard; Pin Count: 2; Value: 1k1; Status: Not Recommended; Power: 0.0625W; Manufacturer Part Number: R0402_1K1_1%_0.0625W_100PPM; Case: 0402; Mounted: Yes; Sense: No; Socket: No; SMD: Yes; Manufacturer1 Example: YAGEO PHYCOMP; Manufacturer1 ComponentHeight: 0.4mm; HelpURL: \\cern.ch\dfs\Applications\Altium\Datasheets\R0402_Phycomp_RC0402.pdf; Author: CERN DEM JLC; CreateDate: 03.12.2007; LatestRevisionDate: 17.10.2012
R62 = R0402_1K5_1%_0.0625W_100PPM: Resistor - 1%; Part Description: General Purpose Thick Film Chip Resistor; Manufacturer: GENERIC; Manufacturer1 Part Number: 232270671502L; TC: ±100ppm/°C; PressFit: No; Part Number: R0402_1K5_1%_0.0625W_100PPM; Component Kind: Standard; Component Type: Standard; Pin Count: 2; Value: 1k5; Status: Not Recommended; Power: 0.0625W; Manufacturer Part Number: R0402_1K5_1%_0.0625W_100PPM; Case: 0402; Mounted: Yes; Sense: No; Socket: No; SMD: Yes; Manufacturer1 Example: YAGEO PHYCOMP; Manufacturer1 ComponentHeight: 0.4mm; HelpURL: \\cern.ch\dfs\Applications\Altium\Datasheets\R0402_Phycomp_RC0402.pdf; Author: CERN DEM JLC; CreateDate: 03.12.2007; LatestRevisionDate: 17.10.2012
R63 = R0402_1K6_1%_0.0625W_100PPM: Resistor - 1%; Part Description: General Purpose Thick Film Chip Resistor; Manufacturer: GENERIC; Manufacturer1 Part Number: 232270671602L; TC: ±100ppm/°C; PressFit: No; Part Number: R0402_1K6_1%_0.0625W_100PPM; Component Kind: Standard; Component Type: Standard; Pin Count: 2; Value: 1k6; Status: Not Recommended; Power: 0.0625W; Manufacturer Part Number: R0402_1K6_1%_0.0625W_100PPM; Case: 0402; Mounted: Yes; Sense: No; Socket: No; SMD: Yes; Manufacturer1 Example: YAGEO PHYCOMP; Manufacturer1 ComponentHeight: 0.4mm; HelpURL: \\cern.ch\dfs\Applications\Altium\Datasheets\R0402_Phycomp_RC0402.pdf; Author: CERN DEM JLC; CreateDate: 03.12.2007; LatestRevisionDate: 17.10.2012
R92 = R0402_56K_1%_0.0625W_100PPM: Resistor - 1%; Part Description: General Purpose Thick Film Chip Resistor; Manufacturer: GENERIC; Manufacturer1 Part Number: 232270675603L; TC: ±100ppm/°C; Part Number: R0402_56K_1%_0.0625W_100PPM; Component Kind: Standard; Component Type: Standard; Pin Count: 2; Value: 56k; Status: Not recommended; Power: 0.0625W; Tolerance: ±1%; Manufacturer Part Number: R0402_56K_1%_0.0625W_100PPM; Case: 0402; Mounted: Yes; Sense: No; Socket: No; SMD: Yes; Manufacturer1 Example: YAGEO PHYCOMP; Manufacturer1 ComponentHeight: 0.4mm; HelpURL: \\cern.ch\dfs\Applications\Altium\Datasheets\R0402_Phycomp_RC0402.pdf; Author: CERN DEM JLC; CreateDate: 03.12.2007; LatestRevisionDate: 17.10.2012
R94 = R0402_47K_1%_0.0625W_100PPM: Resistor - 1%; Part Description: General Purpose Thick Film Chip Resistor; Manufacturer: GENERIC; Manufacturer1 Part Number: 232270675103L; TC: ±100ppm/°C; Part Number: R0402_47K_1%_0.0625W_100PPM; Component Kind: Standard; Component Type: Standard; Pin Count: 2; Value: 47k; Status: Not recommended; Power: 0.0625W; Tolerance: ±1%; Manufacturer Part Number: R0402_47K_1%_0.0625W_100PPM; Case: 0402; Mounted: Yes; Sense: No; Socket: No; SMD: Yes; Manufacturer1 Example: YAGEO PHYCOMP; Manufacturer1 ComponentHeight: 0.4mm; HelpURL: \\cern.ch\dfs\Applications\Altium\Datasheets\R0402_Phycomp_RC0402.pdf; Author: CERN DEM JLC; CreateDate: 03.12.2007; LatestRevisionDate: 17.10.2012
R95 R102 = R0402_3K_1%_0.0625W_100PPM: Resistor - 1%; Part Description: General Purpose Thick Film Chip Resistor; Manufacturer: GENERIC; Manufacturer1 Part Number: 232270673002L; TC: ±100ppm/°C; PressFit: No; Part Number: R0402_3K_1%_0.0625W_100PPM; Component Kind: Standard; Component Type: Standard; Pin Count: 2; Value: 3k; Status: Not Recommended; Power: 0.0625W; Manufacturer Part Number: R0402_3K_1%_0.0625W_100PPM; Case: 0402; Mounted: Yes; Sense: No; Socket: No; SMD: Yes; Manufacturer1 Example: YAGEO PHYCOMP; Manufacturer1 ComponentHeight: 0.4mm; HelpURL: \\cern.ch\dfs\Applications\Altium\Datasheets\R0402_Phycomp_RC0402.pdf; Author: CERN DEM JLC; CreateDate: 03.12.2007; LatestRevisionDate: 17.10.2012
R96 R99 = R0402_33K_1%_0.0625W_100PPM: Resistor - 1%; Part Description: General Purpose Thick Film Chip Resistor; Manufacturer: GENERIC; Manufacturer1 Part Number: 232270673303L; TC: ±100ppm/°C; Part Number: R0402_33K_1%_0.0625W_100PPM; Component Kind: Standard; Component Type: Standard; Pin Count: 2; Value: 33k; Status: Not recommended; Power: 0.0625W; Tolerance: ±1%; Manufacturer Part Number: R0402_33K_1%_0.0625W_100PPM; Case: 0402; Mounted: Yes; Sense: No; Socket: No; SMD: Yes; Manufacturer1 Example: YAGEO PHYCOMP; Manufacturer1 ComponentHeight: 0.4mm; HelpURL: \\cern.ch\dfs\Applications\Altium\Datasheets\R0402_Phycomp_RC0402.pdf; Author: CERN DEM JLC; CreateDate: 03.12.2007; LatestRevisionDate: 17.10.2012
R101 R104 = R0402_30K_1%_0.0625W_100PPM: Resistor - 1%; Part Description: General Purpose Thick Film Chip Resistor; Manufacturer: GENERIC; Manufacturer1 Part Number: 232270673003L; TC: ±100ppm/°C; Part Number: R0402_30K_1%_0.0625W_100PPM; Component Kind: Standard; Component Type: Standard; Pin Count: 2; Value: 30k; Status: Not recommended; Power: 0.0625W; Tolerance: ±1%; Manufacturer Part Number: R0402_30K_1%_0.0625W_100PPM; Case: 0402; Mounted: Yes; Sense: No; Socket: No; SMD: Yes; Manufacturer1 Example: YAGEO PHYCOMP; Manufacturer1 ComponentHeight: 0.4mm; HelpURL: \\cern.ch\dfs\Applications\Altium\Datasheets\R0402_Phycomp_RC0402.pdf; Author: CERN DEM JLC; CreateDate: 03.12.2007; LatestRevisionDate: 17.10.2012
R103 = R0603_80K6_0.1%_0.063W_10PPM: Resistor - 0.1%; Part Description: Thin Film Chip Resistor; Manufacturer: GENERIC; Manufacturer1 Part Number: RN73C1J80K6BTDF; Power: 0.063W; TC: ±10ppm; PressFit: No; Part Number: R0603_80K6_0.1%_0.063W_10PPM; Component Kind: Standard; Component Type: Standard; Pin Count: 2; Value: 80k6; Status: Not Recommended; Tolerance: ±0.1%; Manufacturer Part Number: R0603_80K6_0.1%_0.063W_10PPM; Case: 0603; Mounted: Yes; Sense: No; Socket: No; SMD: Yes; Manufacturer1 Example: TYCO HOLSWORTHY; Manufacturer1 ComponentHeight: 0.5mm; HelpURL: \\cern.ch\dfs\Applications\Altium\Datasheets\R0603_Tyco_RN73.pdf; Author: CERN DEM JLC; CreateDate: 03.12.2007; LatestRevisionDate: 13.03.2008
R105 = R0603_30K9_0.1%_0.063W_10PPM: Resistor - 0.1%; Part Description: Thin Film Chip Resistor; Manufacturer: GENERIC; Manufacturer1 Part Number: RN73C1J30K9BTDF; Power: 0.063W; TC: ±10ppm; PressFit: No; Part Number: R0603_30K9_0.1%_0.063W_10PPM; Component Kind: Standard; Component Type: Standard; Pin Count: 2; Value: 30k9; Status: Not Recommended; Tolerance: ±0.1%; Manufacturer Part Number: R0603_30K9_0.1%_0.063W_10PPM; Case: 0603; Mounted: Yes; Sense: No; Socket: No; SMD: Yes; Manufacturer1 Example: TYCO HOLSWORTHY; Manufacturer1 ComponentHeight: 0.5mm; HelpURL: \\cern.ch\dfs\Applications\Altium\Datasheets\R0603_Tyco_RN73.pdf; Author: CERN DEM JLC; CreateDate: 03.12.2007; LatestRevisionDate: 13.03.2008
R108 R362 R363 = R0402_10K_1%_0.0625W_100PPM: Resistor - 1%; Part Description: General Purpose Thick Film Chip Resistor; Manufacturer: GENERIC; Manufacturer1 Part Number: 232270671003L; TC: ±100ppm/°C; Table: Resistors SMD; Part Number: R0402_10K_1%_0.0625W_100PPM; Component Kind: Standard; Component Type: Standard; Pin Count: 2; Value: 10k; Status: Not recommended; Power: 0.0625W; Tolerance: ±1%; Manufacturer Part Number: R0402_10K_1%_0.0625W_100PPM; Case: 0402; Mounted: Yes; Socket: No; SMD: Yes; Manufacturer1 Example: YAGEO PHYCOMP; Manufacturer1 ComponentHeight: 0.4mm; HelpURL: \\cern.ch\dfs\Applications\Altium\Datasheets\R0402_Phycomp_RC0402.pdf; Author: CERN DEM JLC; CreateDate: 2007-12-03; LatestRevisionDate: 2012-10-17
R110 = R0402_4K3_1%_0.0625W_100PPM: Resistor - 1%; Part Description: General Purpose Thick Film Chip Resistor; Manufacturer: GENERIC; Manufacturer1 Part Number: 232270674302L; TC: ±100ppm/°C; PressFit: No; Part Number: R0402_4K3_1%_0.0625W_100PPM; Component Kind: Standard; Component Type: Standard; Pin Count: 2; Value: 4k3; Status: Not Recommended; Power: 0.0625W; Manufacturer Part Number: R0402_4K3_1%_0.0625W_100PPM; Case: 0402; Mounted: Yes; Sense: No; Socket: No; SMD: Yes; Manufacturer1 Example: YAGEO PHYCOMP; Manufacturer1 ComponentHeight: 0.4mm; HelpURL: \\cern.ch\dfs\Applications\Altium\Datasheets\R0402_Phycomp_RC0402.pdf; Author: CERN DEM JLC; CreateDate: 03.12.2007; LatestRevisionDate: 17.10.2012
R113 = R0402_2K4_1%_0.0625W_100PPM: Resistor - 1%; Part Description: General Purpose Thick Film Chip Resistor; Manufacturer: GENERIC; Manufacturer1 Part Number: 232270672402L; TC: ±100ppm/°C; PressFit: No; Part Number: R0402_2K4_1%_0.0625W_100PPM; Component Kind: Standard; Component Type: Standard; Pin Count: 2; Value: 2k4; Status: Not Recommended; Power: 0.0625W; Manufacturer Part Number: R0402_2K4_1%_0.0625W_100PPM; Case: 0402; Mounted: Yes; Sense: No; Socket: No; SMD: Yes; Manufacturer1 Example: YAGEO PHYCOMP; Manufacturer1 ComponentHeight: 0.4mm; HelpURL: \\cern.ch\dfs\Applications\Altium\Datasheets\R0402_Phycomp_RC0402.pdf; Author: CERN DEM JLC; CreateDate: 03.12.2007; LatestRevisionDate: 17.10.2012
R117 = R0402_0R_JUMPER: Resistor; Part Description: 1A (0.05R Max DC Resistance) Zero Ohm Jumper; Manufacturer: GENERIC; Manufacturer1 Part Number: 232270591001L; PressFit: No; Part Number: R0402_0R_JUMPER; Component Kind: Standard; Component Type: Standard; Pin Count: 2; Value: 0; Status: Not Recommended; Manufacturer Part Number: R0402_0R_JUMPER; Case: 0402; Mounted: Yes; Sense: No; Socket: No; SMD: Yes; Manufacturer1 Example: YAGEO PHYCOMP; Manufacturer1 ComponentHeight: 0.4mm; HelpURL: \\cern.ch\dfs\Applications\Altium\Datasheets\R0402_Phycomp_RC0402.pdf; Author: CERN DEM JLC; CreateDate: 03.12.2007; LatestRevisionDate: 17.10.2012
R364 = R0402_470R_1%_0.0625W_100PPM: Resistor - 1%; Part Description: General Purpose Thick Film Chip Resistor; Manufacturer: GENERIC; Manufacturer1 Part Number: 232270674701L; TC: ±100ppm/°C; PressFit: No; Part Number: R0402_470R_1%_0.0625W_100PPM; Component Kind: Standard; Component Type: Standard; Pin Count: 2; Value: 470; Status: Not Recommended; Power: 0.0625W; Tolerance: ±1%; Manufacturer Part Number: R0402_470R_1%_0.0625W_100PPM; Case: 0402; Mounted: Yes; Sense: No; Socket: No; SMD: Yes; Manufacturer1 Example: YAGEO PHYCOMP; Manufacturer1 ComponentHeight: 0.4mm; HelpURL: \\cern.ch\dfs\Applications\Altium\Datasheets\R0402_Phycomp_RC0402.pdf; Author: CERN DEM JLC; CreateDate: 03.12.2007; LatestRevisionDate: 17.10.2012
T6 = BSH103: N-CHANNEL MOSFET WITH DIODE; Part Description: 30V 850mA N-Channel Enhancement Mode Field-Effect Transistor; Manufacturer: NEXPERIA; PressFit: No; Bonding: No; Part Number: BSH103; Component Kind: Standard; Component Type: Standard; Device: BSH103; PackageDescription: SOT23, 3 pin, Pitch 0.95mm - 1.3mm W X 2.9mm L X 1.1mm H, IPC Medium Density; Manufacturer Part Number: BSH103; Pin Count: 3; Case: SOT23-3; Mounted: Yes; Socket: No; SMD: Yes; Sense: No; ComponentHeight: 1.1mm; HelpURL: \\cern.ch\dfs\Applications\Altium\Datasheets\BSH103.pdf; Author: CERN DEM JLC; CreateDate: 16.03.2010; LatestRevisionDate: 20.06.2017; ClassName: Artix
TP41 TP51 TP52 = SMD_PAD_1.27X1.27MM: Part Description: 1.27mm x 1.27mm PCB Copper Area (SMD Test Point); Mounted: No; Part Number: SMD_PAD_1.27X1.27MM; Component Type: Standard (No BOM); Pin Count: 1; Family: Test Point; Socket: No; SMD: No; Sense: No; Status: None; ComponentHeight: 0mm; HelpURL: Undefined; Author: CERN DEM JLC; CreateDate: 12.01.2008; LatestRevisionDate: 12.01.2008; PackageDescription: 1.27mm x 1.27mm PCB Copper Area (SMD Test Point)

## Sheet Kasli-SOC_bank0.SchDoc: SOC
size 420 x 297 mm; CheckedBy: G.Kasprowicz; Author: F.Switakowski; CompanyName: WUT ISE; DrawnBy: F.Switakowski; Organization: WUT ISE; Address1: PW ISE; Address2: Nowowiejska 15/19 00-665 Warsaw; Address3: gkasprow@gmail.com; DocumentNumber: 2; Revision: 1; SheetNumber: 2; SheetTotal: 18; ModifiedBy: -; CheckedDate: -; Title2: Bank0 & JTAG; DivGrp: WUT ISE; Designer: G.Kasprowicz; ModifiedDate: -; ProjectName: Sensor Box
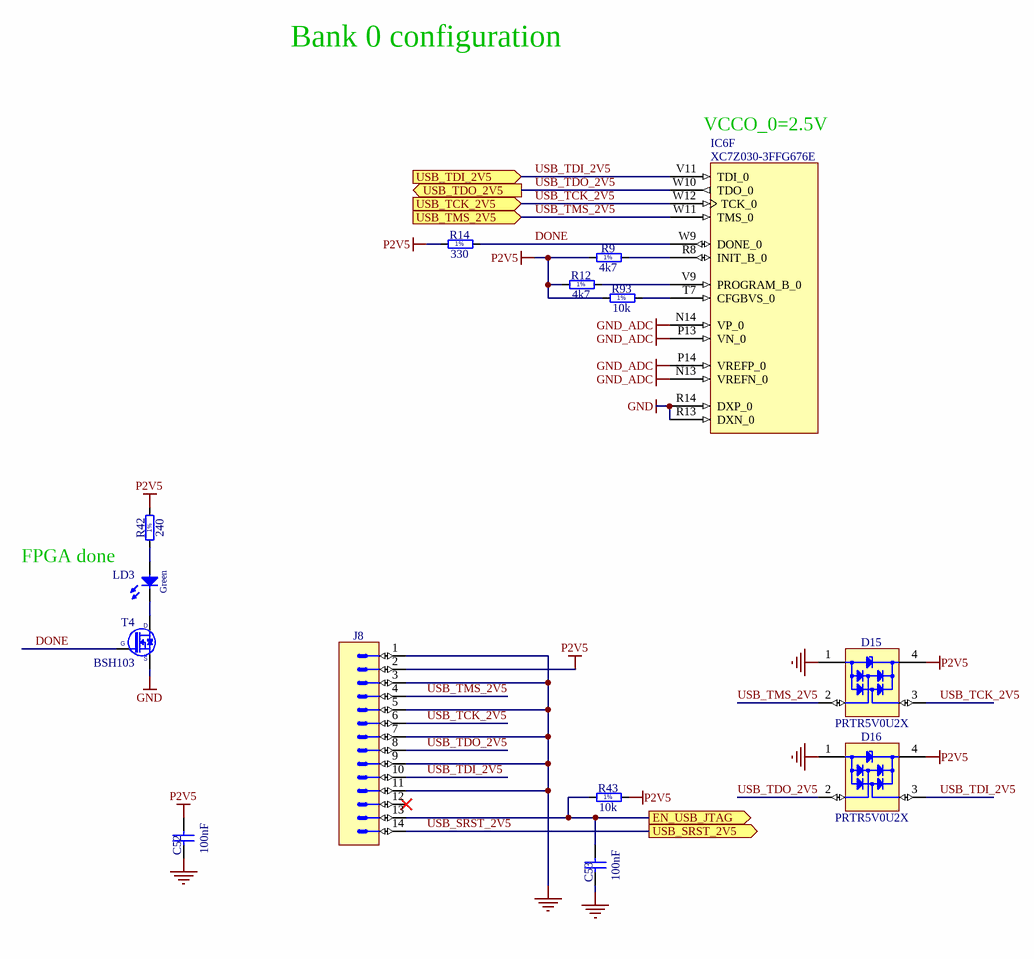
[diagram p16: Kasli-SOC_bank0.SchDoc]

### Parts
C52  100nF  [CAPC1005X55N]
C53  100nF  [CAPC1005X55N]
D15  PRTR5V0U2X  [SOT190P230X110-4N]
D16  PRTR5V0U2X  [SOT190P230X110-4N]
IC6  XC7Z030-3FFG676E  [BGA676C100P26X26_2700X2700X324]  (part F of 14)
J8  Milli-Grid™  [MOLEX_87832-1420]  (value not drawn)
LD3  Green  [LED_KINGBRIGHT_KPH-1608CGCK]
R9  4k7  [RESC1005X40N]
R12  4k7  [RESC1005X40N]
R14  330  [RESC1005X40N]
R42  240  [RESC1005X40N]
R43  10k  [RESC1005X40N]
R93  10k  [RESC1005X40N]
T4  BSH103  [SOT95P230X110-3N]

### Ports
EN_USB_JTAG (out), USB_SRST_2V5 (out), USB_TCK_2V5 (in), USB_TDI_2V5 (in), USB_TDO_2V5 (out), USB_TMS_2V5 (in)

### Nets
GND: C52.1 C53.1 D15.1(GND) D16.1(GND) IC6.R13(DXN_0) IC6.R14(DXP_0) J8.1 J8.3 J8.5 J8.7 J8.9 J8.11 T4.2(S)
GND_ADC: IC6.N13(VREFN_0) IC6.N14(VP_0) IC6.P13(VN_0) IC6.P14(VREFP_0)
P2V5: C52.2 D15.4(VCC) D16.4(VCC) J8.2 R9.1 R12.1 R14.1 R42.2 R43.2 R93.1
DONE: IC6.W9(DONE_0) R14.2 T4.1(G)
EN_USB_JTAG: C53.2 J8.13 R43.1 ; port EN_USB_JTAG
USB_SRST_2V5: J8.14 ; port USB_SRST_2V5
USB_TCK_2V5: D15.3(I/O2) IC6.W12(TCK_0) J8.6 ; port USB_TCK_2V5
USB_TDI_2V5: D16.3(I/O2) IC6.V11(TDI_0) J8.10 ; port USB_TDI_2V5
USB_TDO_2V5: D16.2(I/O1) IC6.W10(TDO_0) J8.8 ; port USB_TDO_2V5
USB_TMS_2V5: D15.2(I/O1) IC6.W11(TMS_0) J8.4 ; port USB_TMS_2V5
NetIC6_R8: IC6.R8(INIT_B_0) R9.2
NetIC6_T7: IC6.T7(CFGBVS_0) R93.2
NetIC6_V9: IC6.V9(PROGRAM_B_0) R12.2
NetLD3_1: LD3.1(C) T4.3(D)
NetLD3_2: LD3.2(A) R42.1

Not connected (* = marked no-connect by the designer): J8 12*

### Notes on the sheet
- Bank 0 configuration
- (near IC6) VCCO_0=2.5V
- FPGA done
- Project/Equipment
- Document
- Designer
- Drawn by
- Check.by
- Copyright WUT ISE 2020.
  This documentation describes Open Hardware and is licensed under the CERN OHL v.1.2. You may redistribute and modify this documentation under the terms of the CERN OHL v.1.2. (http://ohwr.org/CERNOHL). This documentation is distributed WITHOUT ANY EXPRESS OR IMPLIED WARRANTY, INCLUDING OF MERCHANTABILITY, SATISFACTORY QUALITY AND FITNESS FOR A PARTICULAR PURPOSE. Please see the CERN OHL v.1.2 for applicable conditions.
- Contact
- File
- Last Mod.
- Print Date
- Sheet
- Size
- A3
- of
- Rev
- (in symbol R0402_4K7_1%_0.0625W_100PPM) 1%
- (in symbol R0402_10K_1%_0.0625W_100PPM) 1%
- (in symbol R0402_240R_1%_0.0625W_100PPM) 1%
- (in symbol R0402_330R_1%_0.0625W_100PPM) 1%

### Library data of the parts
C52 C53 = CC0402_100NF_16V_10%_X7R: as C146-C153 on sheet Kasli-SOC_QUAD_BUCK; Part Number: CC0402_100NF_16V_10%_X7R; Component Kind: Standard; Component Type: Standard; Pin Count: 2; Value: 100nF; Status: Not Recommended; Manufacturer Part Number: CC0402_100NF_16V_10%_X7R; Case: 0402; Mounted: Yes; Socket: No; SMD: Yes; Sense: No; Manufacturer1 Example: MURATA; Manufacturer1 ComponentHeight: 0.55mm; HelpURL: \\cern.ch\dfs\Applications\Altium\Datasheets\CC0402_X7R_MURATA_GRM.pdf; Author: CERN DEM JLC; CreateDate: 05/12/2013; LatestRevisionDate: 03/12/2007
D15 D16 = PRTR5V0U2X: Ultra Low Capacitance Double Rail-to-Rail ESD Protection Diode; Part Description: Ultra Low Capacitance (1pF) Double Rail-to-Rail ESD Protection Diode (8kV); Manufacturer: NXP SEMICONDUCTORS; Voltage: 5.5V; PressFit: No; Bonding: No; Part Number: PRTR5V0U2X; Component Kind: Standard; Component Type: Standard; Device: PRTR5V0U2X; PackageDescription: SOT143B, SOT, 1.90mm Pitch; 4 Pin, 1.30mm W X 2.90mm L X 1.10mm H body, IPC Medium Density; Manufacturer Part Number: PRTR5V0U2X; Pin Count: 4; Case: SOT143B; Mounted: Yes; Socket: No; SMD: Yes; Sense: No; ComponentHeight: 1.1mm; HelpURL: \\cern.ch\dfs\Applications\Altium\Datasheets\PRTR5V0U2X.pdf; Author: CERN DEM JLC; CreateDate: 22.03.2011; LatestRevisionDate: 22.03.2011
IC6 = XC7Z030-2FFG676I: 733 MHz Zynq™-7000 AP SoC, 130 PS I/O, 254 FPGA I/O, 676-Ball BGA, Speed Grade 2, Industrial Grade, Pb-Free; Part Description: Zynq™-7000 All Programmable SoC, Dual-core ARM® Cortex™-A9 CPU, 676-Ball BGA, Speed Grade 2, Industrial Grade, Pb-Free; Manufacturer: XILINX; PressFit: No; Bonding: No; Part Number: XC7Z030-3FFG676E; Component Kind: Standard; Component Type: Standard; Device: XC7Z030-2FFG676I; PackageDescription: BGA, 1.00mm Pitch, Square; 676 Pin, 26 Columns X 26 Rows, 27.00mm X 27.00mm X 2.60mm H; Manufacturer Part Number: XC7Z030-2FFG676I; Pin Count: 676; Case: BGA676; Mounted: Yes; Socket: No; SMD: Yes; Sense: No; ComponentHeight: 3.24mm; HelpURL: \\cern.ch\dfs\Applications\Altium\Datasheets\XC7Z030-2FFG676I.pdf; ComponentLink1URL: \\cern.ch\dfs\Applications\Altium\Datasheets\XC7Z030-2FFG676I_Package.pdf; ComponentLink1Description: Package; ComponentLink2URL: \\cern.ch\dfs\Applications\Altium\Datasheets\XC7Z030-2FFG676I_Pinout.txt; ComponentLink2Description: Pinout; Author: CERN DEM JLC; CreateDate: 29/04/2014; LatestRevisionDate: 29/04/2014
J8 = MOLEX_87832-1420: Connector 14 Male; Part Description: 2.00mm (.079") Pitch Milli-Grid™ Header, Surface Mount, Vertical, Shrouded, 14 Circuits,with Locking Windows and Centre Polarization Slot, PCB Locator; Manufacturer: MOLEX; PressFit: No; Part Number: MOLEX_87832-1420; Component Kind: Standard; Component Type: Standard; Pin Count: 14; Family: Milli-Grid™; Mounted: Yes; Socket: No; SMD: Yes; Sense: No; Status: None; Manufacturer Part Number: 87832-1420; ComponentHeight: 7.6mm; HelpURL: \\cern.ch\dfs\Applications\Altium\Datasheets\MOLEX_87832-1420.pdf; Author: CERN DEM JLC; CreateDate: 09.09.2008; LatestRevisionDate: 09.09.2008
LD3 = LED_KINGBRIGHT_KPH-1608CGCK: as LD4 on sheet Kasli-SOC_linear; Manufacturer Part Number: KPH-1608CGCK; ComponentHeight: 0.65mm; HelpURL: \\cern.ch\dfs\Applications\Altium\Datasheets\LED_KINGBRIGHT_KPH-1608CGCK.pdf; Part Number: LED_KINGBRIGHT_KPH-1608CGCK; Component Kind: Standard; Component Type: Standard; Color: Green; PackageDescription: SMT Green LED, Case 0603, Body L 1.6 x W 0.8mm H 0.65mm; Manufacturer: KINGBRIGHT; Pin Count: 2; Mounted: Yes; Socket: No; SMD: Yes; Sense: No; Author: CERN DEM JLC; CreateDate: 03.07.2017; LatestRevisionDate: 03.07.2017
R9 R12 = R0402_4K7_1%_0.0625W_100PPM: Resistor - 1%; Part Description: General Purpose Thick Film Chip Resistor; Manufacturer: GENERIC; Manufacturer1 Part Number: 232270674702L; TC: ±100ppm/°C; PressFit: No; Part Number: R0402_4K7_1%_0.0625W_100PPM; Component Kind: Standard; Component Type: Standard; Pin Count: 2; Value: 4k7; Status: Not Recommended; Power: 0.0625W; Tolerance: ±1%; Manufacturer Part Number: R0402_4K7_1%_0.0625W_100PPM; Case: 0402; Mounted: Yes; Sense: No; Socket: No; SMD: Yes; Manufacturer1 Example: YAGEO PHYCOMP; Manufacturer1 ComponentHeight: 0.4mm; HelpURL: \\cern.ch\dfs\Applications\Altium\Datasheets\R0402_Phycomp_RC0402.pdf; Author: CERN DEM JLC; CreateDate: 03.12.2007; LatestRevisionDate: 17.10.2012
R14 = R0402_330R_1%_0.0625W_100PPM: Resistor - 1%; Part Description: General Purpose Thick Film Chip Resistor; Manufacturer: GENERIC; Manufacturer1 Part Number: 232270673301L; TC: ±100ppm/°C; PressFit: No; Part Number: R0402_330R_1%_0.0625W_100PPM; Component Kind: Standard; Component Type: Standard; Pin Count: 2; Value: 330; Status: Not Recommended; Power: 0.0625W; Tolerance: ±1%; Manufacturer Part Number: R0402_330R_1%_0.0625W_100PPM; Case: 0402; Mounted: Yes; Sense: No; Socket: No; SMD: Yes; Manufacturer1 Example: YAGEO PHYCOMP; Manufacturer1 ComponentHeight: 0.4mm; HelpURL: \\cern.ch\dfs\Applications\Altium\Datasheets\R0402_Phycomp_RC0402.pdf; Author: CERN DEM JLC; CreateDate: 03.12.2007; LatestRevisionDate: 17.10.2012
R42 = R0402_240R_1%_0.0625W_100PPM: Resistor - 1%; Part Description: General Purpose Thick Film Chip Resistor; Manufacturer: GENERIC; Manufacturer1 Part Number: 232270672401L; TC: ±100ppm/°C; PressFit: No; Part Number: R0402_240R_1%_0.0625W_100PPM; Component Kind: Standard; Component Type: Standard; Pin Count: 2; Value: 240; Status: Not Recommended; Power: 0.0625W; Tolerance: ±1%; Manufacturer Part Number: R0402_240R_1%_0.0625W_100PPM; Case: 0402; Mounted: Yes; Sense: No; Socket: No; SMD: Yes; Manufacturer1 Example: YAGEO PHYCOMP; Manufacturer1 ComponentHeight: 0.4mm; HelpURL: \\cern.ch\dfs\Applications\Altium\Datasheets\R0402_Phycomp_RC0402.pdf; Author: CERN DEM JLC; CreateDate: 03/12/2007; LatestRevisionDate: 17/10/2012
R43 R93 = R0402_10K_1%_0.0625W_100PPM: Resistor - 1%; Part Description: General Purpose Thick Film Chip Resistor; Manufacturer: GENERIC; Manufacturer1 Part Number: 232270671003L; TC: ±100ppm/°C; PressFit: No; Part Number: R0402_10K_1%_0.0625W_100PPM; Component Kind: Standard; Component Type: Standard; Pin Count: 2; Value: 10k; Status: Not Recommended; Power: 0.0625W; Tolerance: ±1%; Manufacturer Part Number: R0402_10K_1%_0.0625W_100PPM; Case: 0402; Mounted: Yes; Sense: No; Socket: No; SMD: Yes; Manufacturer1 Example: YAGEO PHYCOMP; Manufacturer1 ComponentHeight: 0.4mm; HelpURL: \\cern.ch\dfs\Applications\Altium\Datasheets\R0402_Phycomp_RC0402.pdf; Author: CERN DEM JLC; CreateDate: 03.12.2007; LatestRevisionDate: 17.10.2012
  R43: ClassName: FPGA_JTAG
T4 = BSH103: as T6 on sheet Kasli-SOC_linear; Part Number: BSH103; Component Kind: Standard; Component Type: Standard; Device: BSH103; PackageDescription: SOT23, 3 pin, Pitch 0.95mm - 1.3mm W X 2.9mm L X 1.1mm H, IPC Medium Density; Manufacturer Part Number: BSH103; Pin Count: 3; Case: SOT23-3; Mounted: Yes; Socket: No; SMD: Yes; Sense: No; ComponentHeight: 1.1mm; HelpURL: \\cern.ch\dfs\Applications\Altium\Datasheets\BSH103.pdf; Author: CERN DEM JLC; CreateDate: 16.03.2010; LatestRevisionDate: 20.06.2017; ClassName: Artix